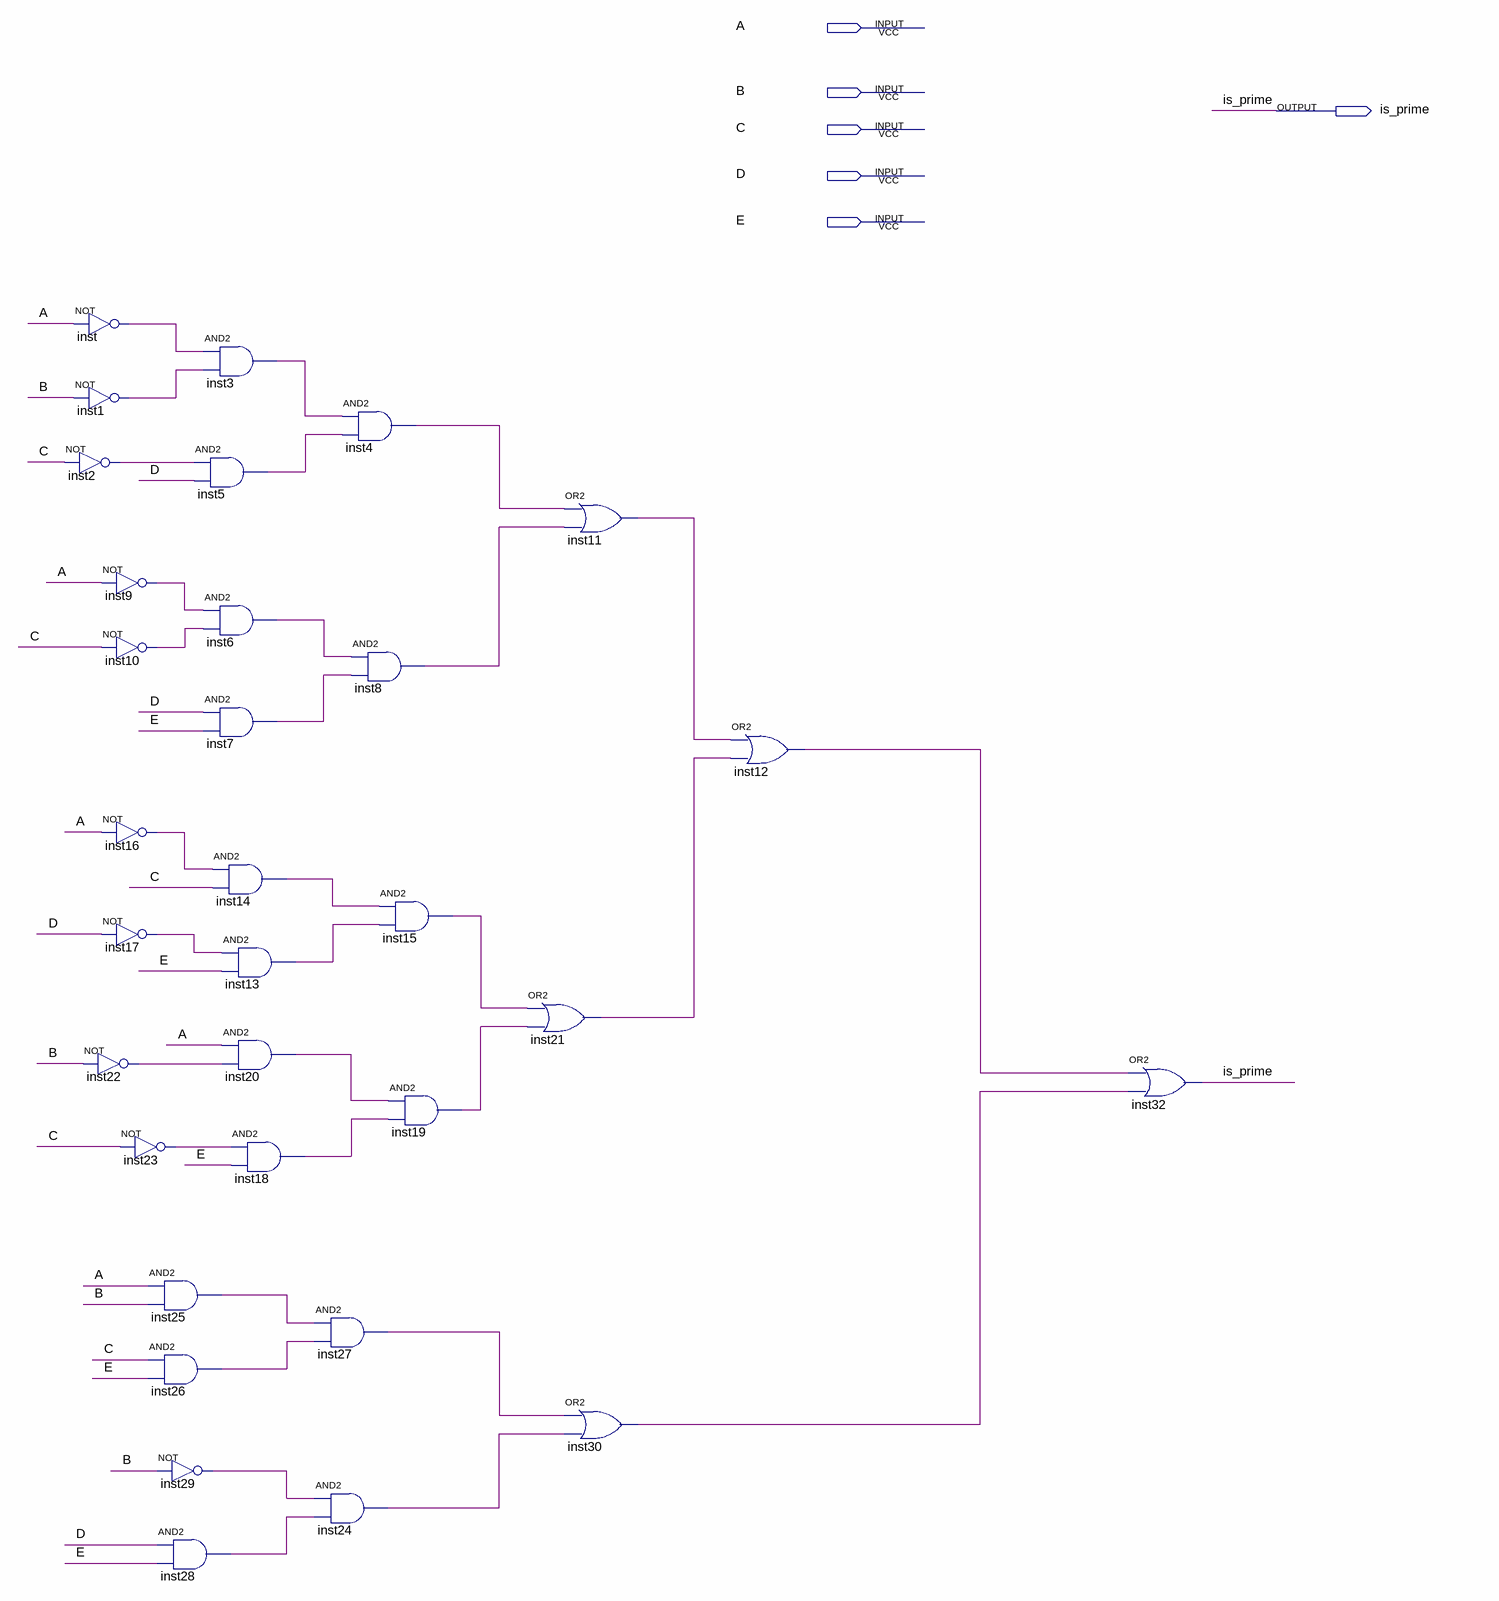
[diagram p0: schematic sheet]
// Quartus schematic prime_5bit.bdf as structural Verilog: 32 symbols, 6 pins
module prime_5bit (
  input  A,
  input  B,
  input  C,
  input  D,
  input  E,
  output is_prime
);

  wire inst1_out, inst2_out, inst3_out, inst4_out, inst5_out, inst6_out, inst7_out, inst8_out, inst9_out,
       inst10_out, inst11_out, inst12_out, inst13_out, inst14_out, inst15_out, inst16_out, inst17_out,
       inst18_out, inst19_out, inst20_out, inst21_out, inst22_out, inst23_out, inst24_out, inst25_out,
       inst26_out, inst27_out, inst28_out, inst29_out, inst30_out, inst_out;

  not inst (inst_out, A);
  not inst1 (inst1_out, B);
  not inst2 (inst2_out, C);
  not inst9 (inst9_out, A);
  not inst10 (inst10_out, C);
  not inst16 (inst16_out, A);
  not inst17 (inst17_out, D);
  not inst22 (inst22_out, B);
  not inst23 (inst23_out, C);
  and inst25 (inst25_out, A, B);
  and inst26 (inst26_out, C, E);
  not inst29 (inst29_out, B);
  and inst28 (inst28_out, D, E);
  and inst3 (inst3_out, inst_out, inst1_out);
  and inst5 (inst5_out, inst2_out, D);
  and inst6 (inst6_out, inst9_out, inst10_out);
  and inst7 (inst7_out, D, E);
  and inst14 (inst14_out, inst16_out, C);
  and inst13 (inst13_out, inst17_out, E);
  and inst20 (inst20_out, A, inst22_out);
  and inst18 (inst18_out, inst23_out, E);
  and inst27 (inst27_out, inst25_out, inst26_out);
  and inst24 (inst24_out, inst29_out, inst28_out);
  and inst4 (inst4_out, inst3_out, inst5_out);
  and inst8 (inst8_out, inst6_out, inst7_out);
  and inst15 (inst15_out, inst14_out, inst13_out);
  and inst19 (inst19_out, inst20_out, inst18_out);
  or inst21 (inst21_out, inst15_out, inst19_out);
  or inst11 (inst11_out, inst4_out, inst8_out);
  or inst30 (inst30_out, inst27_out, inst24_out);
  or inst12 (inst12_out, inst11_out, inst21_out);
  or inst32 (is_prime, inst12_out, inst30_out);
endmodule
